# Altium schematic sheet Schematic_Audio32_V1.schdoc
size 295 x 194 mm
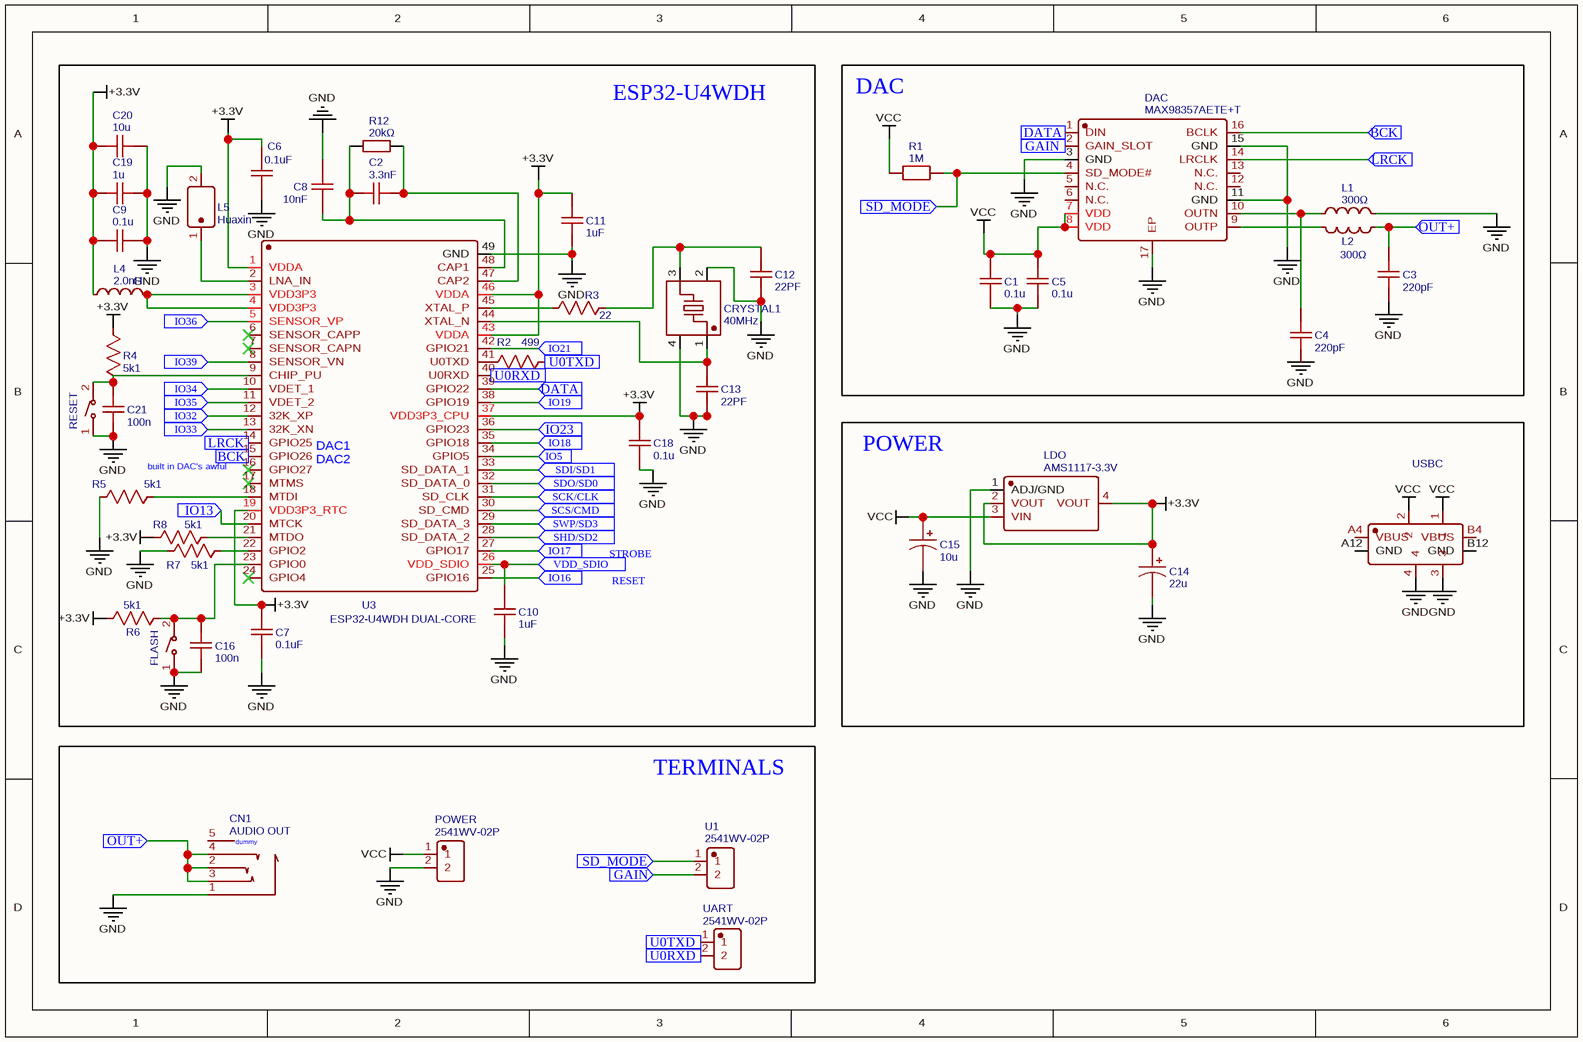
[diagram p0: Schematic_Audio32_V1.schdoc]

## Parts
C1  0.1u  [C0603]
C2  3.3nF  [C0402]
C3  220pF  [C0603]
C4  220pF  [C0603]
C5  0.1u  [C0603]
C6  0.1uF  [C0402]
C7  0.1uF  [C0402]
C8  10nF  [C0402]
C9  0.1u  [C0603]
C10  1uF  [C0402]
C11  1uF  [C0402]
C12  22PF  [C0402]
C13  22PF  [C0402]
C14  22u  [CASE-A_3216]
C15  10u  [CASE-A_3216]
C16  100n  [C0603]
C18  0.1u  [C0603]
C19  1u  [C0603]
C20  10u  [C0603]
C21  100n  [C0603]
CN1  AUDIO OUT  [AUDIO-SMD_PJ-320DB-5A]
CRYSTAL1  40MHz  [CRYSTAL-SMD_4P-L3.2-W2.5-BL_SIT8008BI]
DAC  MAX98357AETE+T  [TQFN-16_L3.0-W3.0-P0.50-BL-EP1.5]
FLASH  TSB008A2530A  [SW-SMD_L6.0-W3.5-LS8.0]  (value not drawn)
L1  300Ω  [BEAD-SMD_L1.6-W0.8-P1.6]
L2  300Ω  [BEAD-SMD_L1.6-W0.8-P1.6]
L4  2.0nH  [L0603]
L5  Huaxin  [ANT-SMD_L3.1-W1.6]
LDO  AMS1117-3.3V  [SOT-223-4_L6.5-W3.5-P2.30-LS7.0-BR]
POWER  2541WV-02P  [HDR-TH_2P-P2.54-V-M-1]
R1  1M  [R0603]
R2  499  [R0603]
R3  22  [R0603]
R4  5k1  [R0603]
R5  5k1  [R0603]
R6  5k1  [R0603]
R7  5k1  [R0603]
R8  5k1  [R0603]
R12  20kΩ  [R0402]
RESET  TSB008A2530A  [SW-SMD_L6.0-W3.5-LS8.0]  (value not drawn)
U1  2541WV-02P  [HDR-TH_2P-P2.54-V-M-1]
U3  ESP32-U4WDH DUAL-CORE  [QFN-48_L5.0-W5.0-P0.35-BL-EP3.7]
UART  2541WV-02P  [HDR-TH_2P-P2.54-V-M-1]
USBC  HYCW263-USBC04-850B  [USB-TYPE-C_HYCW263-USBC04-850B]  (value not drawn)

## Blocks framed on the sheet
ESP32-U4WDH: C2 C6-C13 C16 C18-C21 CRYSTAL1 FLASH L4 L5 R2-R8 R12 RESET U3
DAC: C1 C3-C5 DAC L1 L2 R1
POWER: C14 C15 LDO USBC
TERMINALS: CN1 POWER U1 UART

## Ports
BCK (in), DATA (in), GAIN (in), IO5 (in), IO13 (in), IO16 (in), IO17 (in), IO18 (in), IO19 (in), IO21 (in), IO23 (in), IO32 (in), IO33 (in), IO34 (in), IO35 (in), IO36 (in), IO39 (in), LRCK (in), OUT+ (in), SCK/CLK (in), SCS/CMD (in), SD_MODE (in), SDI/SD1 (in), SDO/SD0 (in), SHD/SD2 (in), SWP/SD3 (in), U0RXD (in), U0TXD (in), VDD_SDIO (in)

## Nets
+3.3V: C6.1 C7.1 C9.1 C11.2 C14.1 C18.2 C19.1 C20.1 L4.1 LDO.2(VOUT) LDO.4(VOUT) R4.1 R6.1 R8.1 U3.1(VDDA) U3.19(VDD3P3_RTC) U3.37(VDD3P3_CPU) U3.43(VDDA) U3.46(VDDA)
GND: C1.1 C3.1 C4.1 C5.1 C6.2 C7.2 C8.2 C9.2 C10.1 C11.1 C12.1 C13.1 C14.2 C15.2 C16.1 C18.1 C19.2 C20.2 C21.1 CN1.1 CRYSTAL1.2(GND) CRYSTAL1.4(GND) DAC.3(GND) DAC.11(GND) DAC.15(GND) DAC.17(EP) FLASH.1 L1.2 L5.2 LDO.1(ADJ/GND) POWER.2 R5.1 R7.1 RESET.1 U3.49(GND) USBC.3 USBC.4
VCC: C1.2 C5.2 C15.1 DAC.7(VDD) DAC.8(VDD) LDO.3(VIN) POWER.1 R1.1 USBC.1 USBC.2
BCK: DAC.16(BCLK) U3.15(GPIO26) ; port BCK
DATA: DAC.1(DIN) U3.39(GPIO22) ; port DATA
GAIN: DAC.2(GAIN_SLOT) U1.2 ; port GAIN
IO5: U3.34(GPIO5) ; port IO5
IO13: U3.20(MTCK) ; port IO13
IO16: U3.25(GPIO16) ; port IO16
IO17: U3.27(GPIO17) ; port IO17
IO18: U3.35(GPIO18) ; port IO18
IO19: U3.38(GPIO19) ; port IO19
IO21: U3.42(GPIO21) ; port IO21
IO23: U3.36(GPIO23) ; port IO23
IO32: U3.12(32K_XP) ; port IO32
IO33: U3.13(32K_XN) ; port IO33
IO34: U3.10(VDET_1) ; port IO34
IO35: U3.11(VDET_2) ; port IO35
IO36: U3.5(SENSOR_VP) ; port IO36
IO39: U3.8(SENSOR_VN) ; port IO39
LRCK: DAC.14(LRCLK) U3.14(GPIO25) ; port LRCK
OUT+: C3.2 CN1.2 CN1.3 CN1.4 L2.1 ; port OUT+
SCK/CLK: U3.31(SD_CLK) ; port SCK/CLK
SCS/CMD: U3.30(SD_CMD) ; port SCS/CMD
SD_MODE: DAC.4(SD_MODE#) R1.2 U1.1 ; port SD_MODE
SDI/SD1: U3.33(SD_DATA_1) ; port SDI/SD1
SDO/SD0: U3.32(SD_DATA_0) ; port SDO/SD0
SHD/SD2: U3.28(SD_DATA_2) ; port SHD/SD2
SWP/SD3: U3.29(SD_DATA_3) ; port SWP/SD3
U0RXD: U3.40(U0RXD) UART.2 ; port U0RXD
U0TXD: R2.2 UART.1 ; port U0TXD
VDD_SDIO: C10.2 U3.26(VDD_SDIO) ; port VDD_SDIO
NetC2_1: C2.1 R12.2 U3.47(CAP2)
NetC2_2: C2.2 C8.1 R12.1 U3.48(CAP1)
NetC4_2: C4.2 DAC.10(OUTN) L1.1
NetC12_2: C12.2 CRYSTAL1.3 R3.2
NetC13_2: C13.2 CRYSTAL1.1 U3.44(XTAL_N)
NetC16_2: C16.2 FLASH.2 R6.2 U3.23(GPIO0)
NetC21_2: C21.2 R4.2 RESET.2 U3.9(CHIP_PU)
NetDAC_9: DAC.9(OUTP) L2.2
NetL4_2: L4.2 U3.3(VDD3P3) U3.4(VDD3P3)
NetL5_1: L5.1 U3.2(LNA_IN)
NetR2_1: R2.1 U3.41(U0TXD)
NetR3_1: R3.1 U3.45(XTAL_P)
NetR5_2: R5.2 U3.18(MTDI)
NetR7_2: R7.2 U3.22(GPIO2)
NetR8_2: R8.2 U3.21(MTDO)

Not connected (* = marked no-connect by the designer): CN1 5; DAC 5(N.C.) 6(N.C.) 12(N.C.) 13(N.C.); U3 6(SENSOR_CAPP)* 7(SENSOR_CAPN)* 16(GPIO27)* 17(MTMS)* 24(GPIO4)*; USBC A4(VBUS) A12(GND) B4(VBUS) B12(GND)

## Notes on the sheet
- (near U3) DAC1
- built in DAC's awful
- (near U3) DAC2
- RESET
- STROBE
- (in symbol AUDIO OUT) dummy

## Library data of the parts
C1 C5 C9 C18 = 0.1u: nameAlias: Value(F); Contributor: LCEDA_Lib; spicePre: C; spiceSymbolName: C_0603_US
C2 = 3.3nF: Manufacturer: TDK; Manufacturer Part: CGA2B2X7R1H332KT0Y0F; nameAlias: Value; Contributor: LCSC; Supplier: LCSC; Supplier Part: C338095; JLCPCB Part Class: Extended Part; link: https://lcsc.com/eda_search?q=C338095&%26type=1&ref=editor; spicePre: C; spiceSymbolName: CGA2B2X7R1H332KT0Y0F
C3 C4 = 220pF: nameAlias: Value(F); Contributor: LCEDA_Lib; spicePre: C; spiceSymbolName: C_0603_US
C6 C7 = 0.1uF: Manufacturer: PSA(信昌电陶); Manufacturer Part: FN15B104M160PNG; Contributor: lcsc; nameAlias: Value; 3DModel: C0402_L1.0-W0.5-H0.5; Supplier: LCSC; Supplier Part: C2874743; JLCPCB Part Class: Extended Part; link: https://lcsc.com/eda_search?q=C2874743&%26type=1&ref=editor; spicePre: C; spiceSymbolName: FN15B104M160PNG
C8 = 10nF: Manufacturer: TDK; Manufacturer Part: CGA2B3X5R1V103K050BB; Contributor: lcsc; nameAlias: Value; Supplier: LCSC; Supplier Part: C2180663; link: https://lcsc.com/eda_search?q=C2180663&%26type=1&ref=editor; spicePre: C; spiceSymbolName: CGA2B3X5R1V103K050BB
C10 C11 = 1uF: Manufacturer: SANYEAR(叁叶源); Manufacturer Part: C0402X6S105K6R3NT; nameAlias: Value; Contributor: LCSC; Supplier: LCSC; Supplier Part: C2844323; JLCPCB Part Class: Extended Part; link: https://lcsc.com/eda_search?q=C2844323&%26type=1&ref=editor; spicePre: C; spiceSymbolName: C0402X6S105K6R3NT
C12 C13 = 22PF: Manufacturer: null; Manufacturer Part: 22pF/6.3V(10%)-0402; Contributor: LCSC; Supplier: LCSC; Supplier Part: C9900004403; JLCPCB Part Class: Extended Part; link: https://lcsc.com/eda_search?q=C9900004403&%26type=1&ref=editor; spicePre: C; spiceSymbolName: 22PF/6.3V(10%)-0402
C14 = 22u: nameAlias: Value(F); Contributor: LCEDA_Lib; spicePre: C; spiceSymbolName: C_Tan_SMD_A_US
C15 C20 = 10u: nameAlias: Value(F); Contributor: LCEDA_Lib; spicePre: C
  C15: spiceSymbolName: C_Tan_SMD_A_US
  C20: spiceSymbolName: C_0603_US
C16 C21 = 100n: nameAlias: Value(F); Contributor: LCEDA_Lib; spicePre: C; spiceSymbolName: C_0603_US
C19 = 1u: nameAlias: Value(F); Contributor: LCEDA_Lib; spicePre: C; spiceSymbolName: C_0603_US
CN1 = AUDIO OUT: Manufacturer: 韩国韩荣; Manufacturer Part: PJ-320DB-5A; Contributor: LCSC; Supplier: LCSC; Supplier Part: C707225; JLCPCB Part Class: Extended Part; spicePre: C; spiceSymbolName: PJ-320DB-5A
CRYSTAL1 = 40MHz: Manufacturer: HUAXIN(华昕); Manufacturer Part: CF4040M00009001; nameAlias: Value; Contributor: lcsc; Supplier: LCSC; Supplier Part: C7294597; spicePre: C; spiceSymbolName: CF4040M00009001
DAC = MAX98357AETE+T: Manufacturer: ADI(亚德诺)/MAXIM(美信); Contributor: LCSC; Supplier: LCSC; Supplier Part: C910544; Manufacturer Part: MAX98357AETE+T; JLCPCB Part Class: Extended Part; spicePre: U; spiceSymbolName: MAX98357AETE+T
FLASH RESET = TSB008A2530A: Manufacturer: BZCN(博众电气); Contributor: LCSC; Supplier: LCSC; Supplier Part: C2888954; Manufacturer Part: TSB008A2530A; JLCPCB Part Class: Extended Part; spicePre: S; spiceSymbolName: TSB008A2530A
L1 L2 = 300Ω: Manufacturer: FH(风华); Manufacturer Part: CBW160808U301T; nameAlias: Value; Supplier: LCSC; Supplier Part: C139179; JLCPCB Part Class: Extended Part; spicePre: L; spiceSymbolName: CBW160808U301T
L4 = 2.0nH: nameAlias: Value(H); Contributor: LCEDA_Lib; spicePre: L; spiceSymbolName: L0603_US
L5 = Huaxin: Manufacturer: Walsin(华新科); Manufacturer Part: RFECA3216060A1T; nameAlias: Value; Contributor: LCSC; Supplier: LCSC; Supplier Part: C127620; JLCPCB Part Class: Extended Part; spicePre: L; spiceSymbolName: RFECA3216060A1T
LDO = AMS1117-3.3V: Manufacturer: WPMtek(维攀); Contributor: LCSC; Supplier: LCSC; Supplier Part: C2688239; Manufacturer Part: AMS1117-3.3V; JLCPCB Part Class: Extended Part; spicePre: U; spiceSymbolName: AMS1117-3.3V
POWER U1 UART = 2541WV-02P: Manufacturer: HanElectricity(瀚源); Contributor: lcsc; Supplier: LCSC; Supplier Part: C5383111; Manufacturer Part: 2541WV-02P; spicePre: U; spiceSymbolName: 2541WV-02P
R1 = 1M: nameAlias: Value(Ω); Contributor: LCEDA_Lib; spicePre: R; spiceSymbolName: R_0603_EU
R2 = 499: nameAlias: Value(Ω); Contributor: LCEDA_Lib; spicePre: R; spiceSymbolName: R_0603_US
R3 = 22: nameAlias: Value(Ω); Contributor: LCEDA_Lib; spicePre: R; spiceSymbolName: R_0603_US
R4-R8 = 5k1: nameAlias: Value(Ω); Contributor: LCEDA_Lib; spicePre: R; spiceSymbolName: R_0603_US
R12 = 20kΩ: Manufacturer: UNI-ROYAL(厚声); Manufacturer Part: 0402WGF2002TCE; nameAlias: Value; Supplier: LCSC; Supplier Part: C25765; JLCPCB Part Class: Basic Part; link: https://lcsc.com/eda_search?q=C25765&%26type=1&ref=editor; spicePre: R; spiceSymbolName: 0402WGF2002TCE
U3 = ESP32-U4WDH DUAL-CORE: Manufacturer: ESPRESSIF(乐鑫); Contributor: LCSC; nameAlias: Value; Supplier: LCSC; Supplier Part: C20622217; Manufacturer Part: ESP32-U4WDH; JLCPCB Part Class: Extended Part; spicePre: U; spiceSymbolName: ESP32-D0WD; link: https://lcsc.com/eda_search?q=C20622217&%26type=1&ref=editor
USBC = HYCW263-USBC04-850B: Manufacturer: 华宇创; Contributor: lcsc; Supplier: LCSC; Supplier Part: C3034197; Manufacturer Part: HYCW263-USBC04-850B; spicePre: U; spiceSymbolName: HYCW263-USBC04-850B